# Altium schematic sheet CPU Module.SchDoc
size A2 portrait
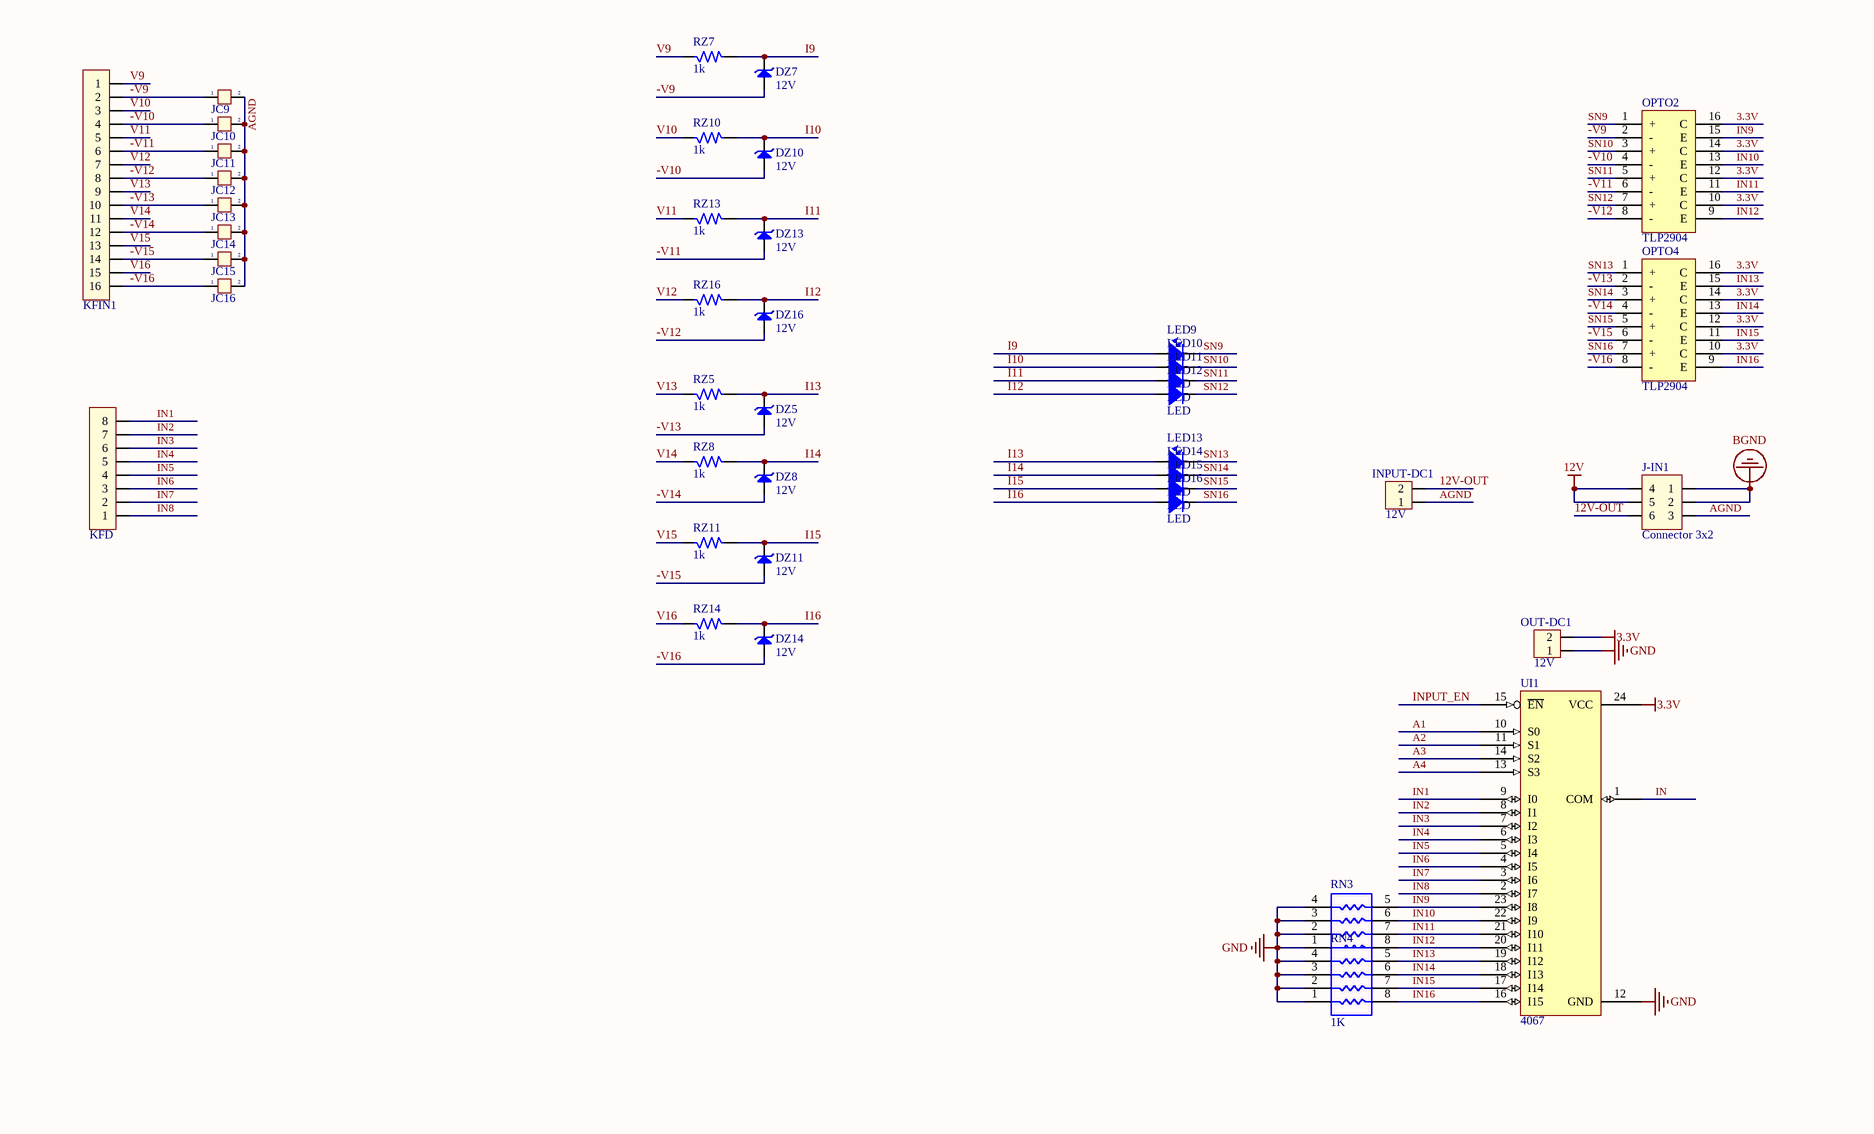
[diagram p0: CPU Module.SchDoc, top]
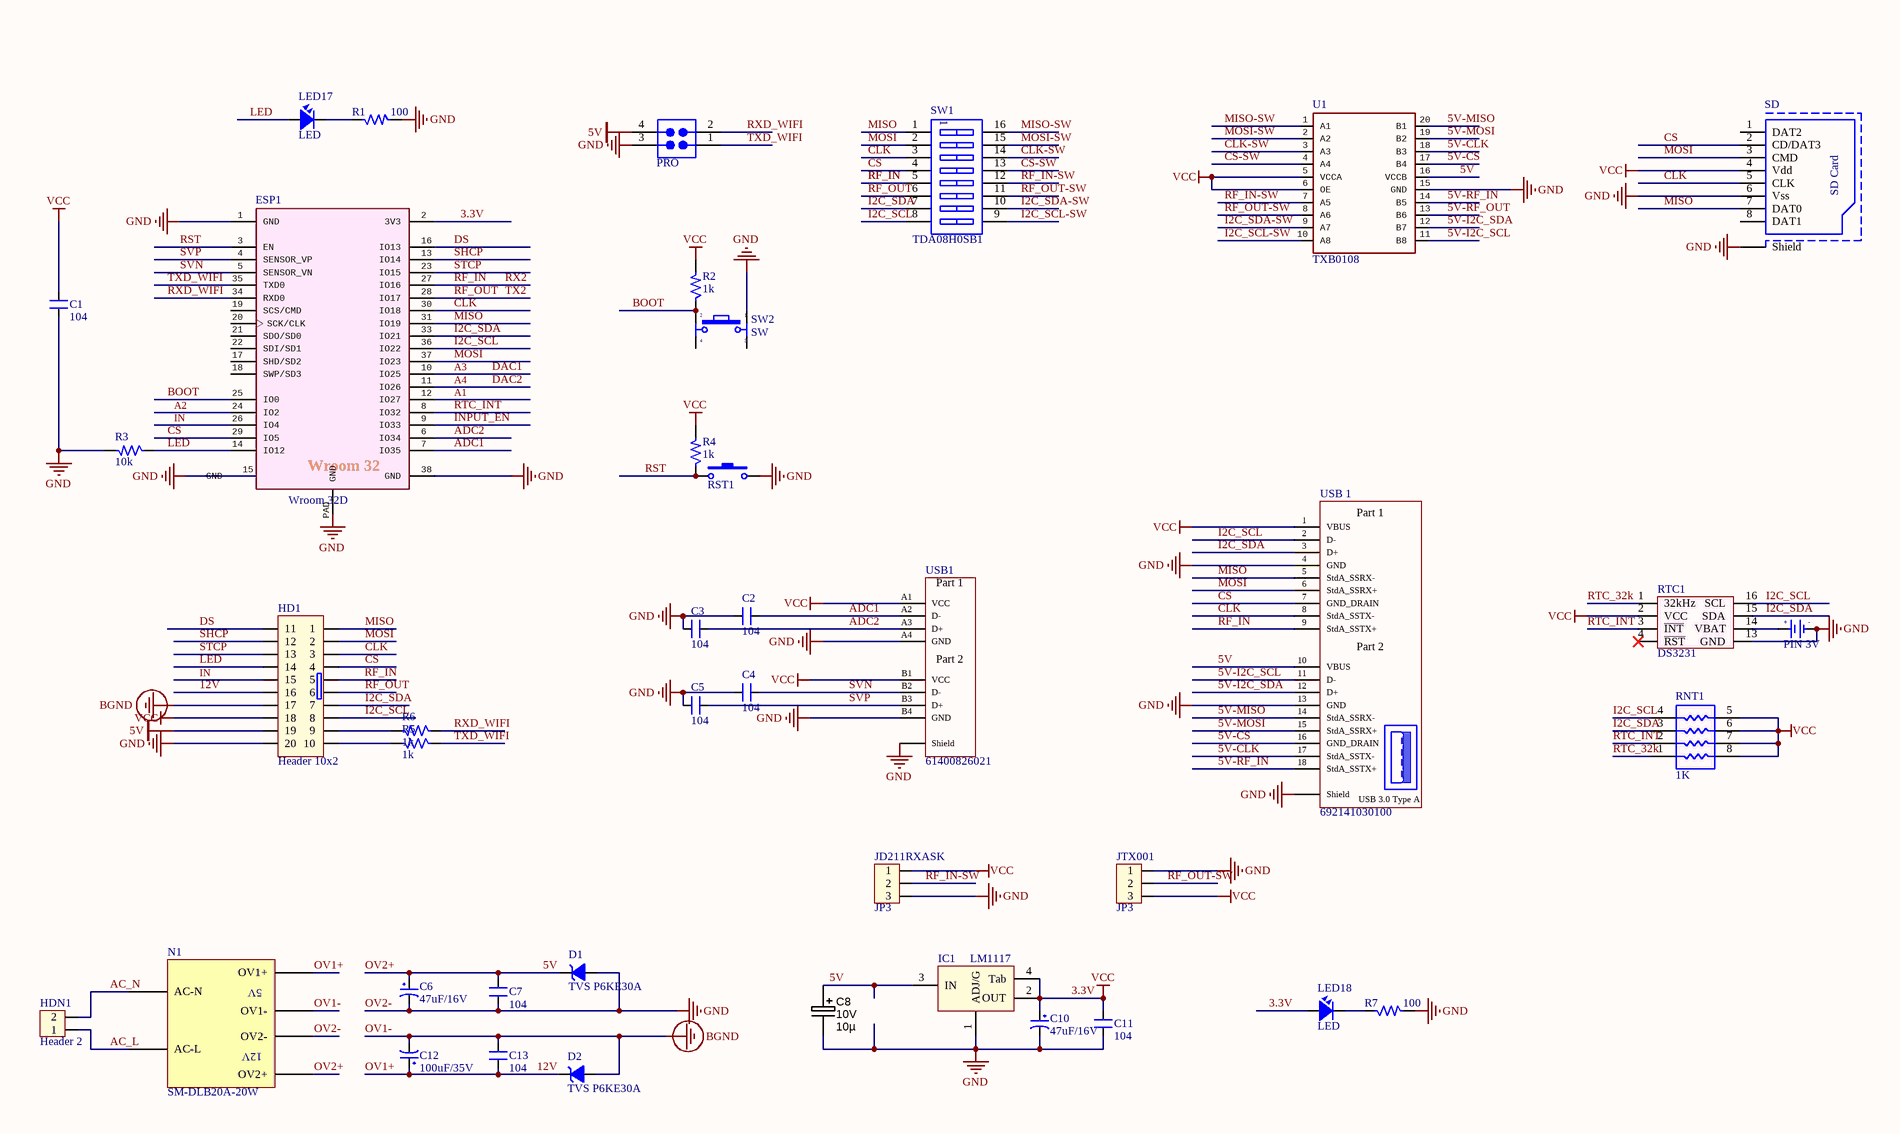
[diagram p1: CPU Module.SchDoc, bottom]

## Parts
BT1  PIN 3V  [PIN CR1220-SMD]
C1  104  [SM-0805]
C2  104  [SM-0805]
C3  104  [SM-0805]
C4  104  [SM-0805]
C5  104  [SM-0805]
C6  47uF/16V  [WCAP-AS5H_6.3x5.5]
C7  104  [SM-0805]
C8  Ratings: 10V  [CAPMP3216X180N]  (hidden comment: 10µ)
C10  47uF/16V  [WCAP-AS5H_6.3x5.5]
C11  104  [SM-0805]
C12  100uF/35V  [WCAP-AS5H_8x10.5]
C13  104  [SM-0805]
D1  TVS P6KE30A  [DO-214AA_Unidirectional]
D2  TVS P6KE30A  [DO-214AA_Unidirectional]
DZ5  12V  [DIOS 1S2P1406H]
DZ7  12V  [DIOS 1S2P1406H]
DZ8  12V  [DIOS 1S2P1406H]
DZ10  12V  [DIOS 1S2P1406H]
DZ11  12V  [DIOS 1S2P1406H]
DZ13  12V  [DIOS 1S2P1406H]
DZ14  12V  [DIOS 1S2P1406H]
DZ16  12V  [DIOS 1S2P1406H]
ESP1  Wroom 32D  [MODULE_ESP-WROOM-32]
HD1  Header 10x2  [Hed2X10S]
HDN1  Header 2  [KF211V- 2]
IC1  LM1117  [SOT223-4N]
INPUT-DC1  12V  [KF211V- 2]
J-IN1  Connector 3x2  [JP3x2]
JC9  Jumper 2  [JP2]  (value not drawn)
JC10  Jumper 2  [JP2]  (value not drawn)
JC11  Jumper 2  [JP2]  (value not drawn)
JC12  Jumper 2  [JP2]  (value not drawn)
JC13  Jumper 2  [JP2]  (value not drawn)
JC14  Jumper 2  [JP2]  (value not drawn)
JC15  Jumper 2  [JP2]  (value not drawn)
JC16  Jumper 2  [JP2]  (value not drawn)
JD211RXASK  JP3  [JP3]
JTX001  JP3  [JP3]
KFD  Header 8  [KF211V- 8]  (value not drawn)
KFIN1  Header 16  [KF211V- 16]  (value not drawn)
LED9  LED  [LED0805]
LED10  LED  [LED0805]
LED11  LED  [LED0805]
LED12  LED  [LED0805]
LED13  LED  [LED0805]
LED14  LED  [LED0805]
LED15  LED  [LED0805]
LED16  LED  [LED0805]
LED17  LED  [LED0805]
LED18  LED  [LED0805]
N1  SM-DLB20A-20W  [SM-DLB20A]
OPTO2  TLP2904  [SO-16]
OPTO4  TLP2904  [SO-16]
OUT-DC1  12V  [KF211V- 2]
PRO  61300421821  [61300421121]  (value not drawn)
R1  100  [R-0805]
R2  1k  [R-0805]
R3  10k  [R-0805]
R4  1k  [R-0805]
R5  1k  [R-0805]
R6  1k  [R-0805]
R7  100  [R-0805]
RN3  1K  [RES P4 Dual 0805/2012]
RN4  1K  [RES P4 Dual 0805/2012]
RNT1  1K  [RES P4 Dual 0805/2012]
RST1  SW-SMD  [SW-SMD]  (value not drawn)
RTC1  DS3231  [SOIC127P750X1030-16N]
RZ5  1k  [SM-1206]
RZ7  1k  [SM-1206]
RZ8  1k  [SM-1206]
RZ10  1k  [SM-1206]
RZ11  1k  [SM-1206]
RZ13  1k  [SM-1206]
RZ14  1k  [SM-1206]
RZ16  1k  [SM-1206]
SD  693072010801  [693072010801]  (value not drawn)
SW1  TDA08H0SB1  [SW8-416131160808]
SW2  SW  [SW2-D2]
U1  TXB0108  [TSSOP65P440X650-20N]
UI1  4067  [SSOP65P530X850-24N]
USB1  61400826021  [61400826021]
USB_1  692141030100  [692141030100]

## Nets
3.3V: C1.2 C10.1 C11.2 ESP1.2(3V3) HD1.18 IC1.2(OUT) IC1.4(Tab) JD211RXASK.1 JTX001.3 LED18.1 OPTO2.10(C) OPTO2.12(C) OPTO2.14(C) OPTO2.16(C) OPTO4.10(C) OPTO4.12(C) OPTO4.14(C) OPTO4.16(C) OUT-DC1.2 R2.2 R4.2 RNT1.5 RNT1.6 RNT1.7 RNT1.8 RTC1.2(VCC) SD.4(Vdd) U1.5(VCCA) U1.6(OE) UI1.24(VCC) USB1.A1(VCC) USB1.B1(VCC) USB_1.1(VBUS)  [also labelled VCC]
5V: C6.1 C7.1 C8.1 D1.2(K) HD1.19 IC1.3(IN) N1.OV2+ PRO.4 U1.16(VCCB) USB_1.10(VBUS)  [also labelled OV2+]
12V: C12.1 C13.2 D2.2(K) HD1.16 J-IN1.4 J-IN1.5 N1.OV1+  [also labelled OV1+]
OV1-: C12.2 C13.1 D2.1(A) HD1.17 J-IN1.1 J-IN1.2 N1.OV1-  [also labelled BGND]
OV2-: BT1.2(GND) C1.1 C2.2 C3.1 C4.2 C5.1 C6.2 C7.2 C8.2 C10.2 C11.1 D1.1(A) ESP1.1(GND) ESP1.15(GND) ESP1.38(GND) ESP1.PAD(GND) HD1.20 IC1.1(ADJ/G) JD211RXASK.3 JTX001.1 N1.OV2- OUT-DC1.1 PRO.3 R1.2 R3.2 R7.2 RN3.1 RN3.2 RN3.3 RN3.4 RN4.1 RN4.2 RN4.3 RN4.4 RST1.2 RTC1.13(GND) SD.6(Vss) SD.Shield SW2.1 U1.15(GND) UI1.12(GND) USB1.A4(GND) USB1.B4(GND) USB1.Shell(Shield) USB_1.4(GND) USB_1.13(GND) USB_1.Shell(Shield)  [also labelled GND]
5V-CLK: U1.18(B3) USB_1.17(StdA_SSTX-)
5V-CS: U1.17(B4) USB_1.16(GND_DRAIN)
5V-I2C_SCL: U1.11(B8) USB_1.11(D-)
5V-I2C_SDA: U1.12(B7) USB_1.12(D+)
5V-MISO: U1.20(B1) USB_1.14(StdA_SSRX-)
5V-MOSI: U1.19(B2) USB_1.15(StdA_SSRX+)
5V-RF_IN: U1.14(B5) USB_1.18(StdA_SSTX+)
5V-RF_OUT: U1.13(B6)
12V-OUT: INPUT-DC1.2 J-IN1.6
-V9: DZ7.1(A) JC9.1 KFIN1.2 OPTO2.2(-)
-V10: DZ10.1(A) JC10.1 KFIN1.4 OPTO2.4(-)
-V11: DZ13.1(A) JC11.1 KFIN1.6 OPTO2.6(-)
-V12: DZ16.1(A) JC12.1 KFIN1.8 OPTO2.8(-)
-V13: DZ5.1(A) JC13.1 KFIN1.10 OPTO4.2(-)
-V14: DZ8.1(A) JC14.1 KFIN1.12 OPTO4.4(-)
-V15: DZ11.1(A) JC15.1 KFIN1.14 OPTO4.6(-)
-V16: DZ14.1(A) JC16.1 KFIN1.16 OPTO4.8(-)
A1: ESP1.12(IO27) UI1.10(S0)
A2: ESP1.24(IO2) UI1.11(S1)
A3: ESP1.10(IO25) UI1.14(S2)  [also labelled DAC1]
A4: ESP1.11(IO26) UI1.13(S3)  [also labelled DAC2]
AC_L: HDN1.1 N1.AC-L
AC_N: HDN1.2 N1.AC-N
ADC1: C2.1 ESP1.7(IO35) USB1.A2(D-)
ADC2: C3.2 ESP1.6(IO34) USB1.A3(D+)
AGND: INPUT-DC1.1 J-IN1.3 JC9.2 JC10.2 JC11.2 JC12.2 JC13.2 JC14.2 JC15.2 JC16.2
BOOT: ESP1.25(IO0) R2.1 SW2.2
CLK: ESP1.30(IO18) HD1.3 SD.5(CLK) SW1.3 USB_1.8(StdA_SSTX-)
CLK-SW: SW1.14 U1.3(A3)
CS: ESP1.29(IO5) HD1.4 SD.2(CD/DAT3) SW1.4 USB_1.7(GND_DRAIN)
CS-SW: SW1.13 U1.4(A4)
DS: ESP1.16(IO13) HD1.11
I2C_SCL: ESP1.36(IO22) HD1.8 RNT1.4 RTC1.16(SCL) SW1.8 USB_1.2(D-)
I2C_SCL-SW: SW1.9 U1.10(A8)
I2C_SDA: ESP1.33(IO21) HD1.7 RNT1.3 RTC1.15(SDA) SW1.7 USB_1.3(D+)
I2C_SDA-SW: SW1.10 U1.9(A7)
I9: DZ7.2(K) LED9.1 RZ7.2
I10: DZ10.2(K) LED10.1 RZ10.2
I11: DZ13.2(K) LED11.1 RZ13.2
I12: DZ16.2(K) LED12.1 RZ16.2
I13: DZ5.2(K) LED13.1 RZ5.2
I14: DZ8.2(K) LED14.1 RZ8.2
I15: DZ11.2(K) LED15.1 RZ11.2
I16: DZ14.2(K) LED16.1 RZ14.2
IN: ESP1.26(IO4) HD1.15 UI1.1(COM)
IN1: KFD.8 UI1.9(I0)
IN2: KFD.7 UI1.8(I1)
IN3: KFD.6 UI1.7(I2)
IN4: KFD.5 UI1.6(I3)
IN5: KFD.4 UI1.5(I4)
IN6: KFD.3 UI1.4(I5)
IN7: KFD.2 UI1.3(I6)
IN8: KFD.1 UI1.2(I7)
IN9: OPTO2.15(E) RN3.5 UI1.23(I8)
IN10: OPTO2.13(E) RN3.6 UI1.22(I9)
IN11: OPTO2.11(E) RN3.7 UI1.21(I10)
IN12: OPTO2.9(E) RN3.8 UI1.20(I11)
IN13: OPTO4.15(E) RN4.5 UI1.19(I12)
IN14: OPTO4.13(E) RN4.6 UI1.18(I13)
IN15: OPTO4.11(E) RN4.7 UI1.17(I14)
IN16: OPTO4.9(E) RN4.8 UI1.16(I15)
INPUT_EN: ESP1.9(IO33) UI1.15(~{EN})
LED: ESP1.14(IO12) HD1.14 LED17.1 R3.1
MISO: ESP1.31(IO19) HD1.1 SD.7(DAT0) SW1.1 USB_1.5(StdA_SSRX-)
MISO-SW: SW1.16 U1.1(A1)
MOSI: ESP1.37(IO23) HD1.2 SD.3(CMD) SW1.2 USB_1.6(StdA_SSRX+)
MOSI-SW: SW1.15 U1.2(A2)
RF_IN: ESP1.27(IO16) HD1.5 SW1.5 USB_1.9(StdA_SSTX+)  [also labelled RX2]
RF_IN-SW: JD211RXASK.2 SW1.12 U1.7(A5)
RF_OUT: ESP1.28(IO17) HD1.6 SW1.6  [also labelled TX2]
RF_OUT-SW: JTX001.2 SW1.11 U1.8(A6)
RST: ESP1.3(EN) R4.1 RST1.1
RTC_32k: RNT1.1 RTC1.1(32kHz)
RTC_INT: ESP1.8(IO32) RNT1.2 RTC1.3(~{INT})
RXD_WIFI: ESP1.34(RXD0) PRO.2 R6.1
SHCP: ESP1.13(IO14) HD1.12
SN9: LED9.2 OPTO2.1(+)
SN10: LED10.2 OPTO2.3(+)
SN11: LED11.2 OPTO2.5(+)
SN12: LED12.2 OPTO2.7(+)
SN13: LED13.2 OPTO4.1(+)
SN14: LED14.2 OPTO4.3(+)
SN15: LED15.2 OPTO4.5(+)
SN16: LED16.2 OPTO4.7(+)
STCP: ESP1.23(IO15) HD1.13
SVN: C4.1 ESP1.5(SENSOR_VN) USB1.B2(D-)
SVP: C5.2 ESP1.4(SENSOR_VP) USB1.B3(D+)
TXD_WIFI: ESP1.35(TXD0) PRO.1 R5.1
V9: KFIN1.1 RZ7.1
V10: KFIN1.3 RZ10.1
V11: KFIN1.5 RZ13.1
V12: KFIN1.7 RZ16.1
V13: KFIN1.9 RZ5.1
V14: KFIN1.11 RZ8.1
V15: KFIN1.13 RZ11.1
V16: KFIN1.15 RZ14.1
NetBT1_1: BT1.1(+3V) RTC1.14(VBAT)
NetHD1_9: HD1.9 R6.2
NetHD1_10: HD1.10 R5.2
NetLED17_2: LED17.2 R1.1
NetLED18_2: LED18.2 R7.1

Not connected (* = marked no-connect by the designer): ESP1 17(SHD/SD2) 18(SWP/SD3) 19(SCS/CMD) 20(SCK/CLK) 21(SDO/SD0) 22(SDI/SD1); RTC1 4(~{RST})*; SD 1(DAT2) 8(DAT1); SW2 3 4

## Notes on the sheet
- Title
- Size:
- Date:
- File:
- A2
- Number:
- Time:
- Revision:
- Sheet
- of
- (in symbol ESP-WROOM-32) Wroom 32
- (in symbol PIN 3V) +; -
- (in symbol SD-693072010801) SD Card
- (in symbol SM-DLB20A-20W) 5V; 12V
- (in symbol USB 2.0 Type A Female THR Stacked) Part 1; Part 2
- (in symbol USB 3.0 Type A Female THR Stacked) Part 1; Part 2

## Library data of the parts
BT1 = PIN 3V: Lithium Battery Holder for CR2032 3V Cell
C1-C5 C7 C11 C13 = CM: Cap SMD; Value: 103
C6 C10 C12 = CP3: Cap 100uF/35V - 470uF/16V; Value: 100uF/35V/50V; Description 1: 1000uF/6,3V - 470uF/16V - 330uF - 25V; Description 2: 220uF/35V - 100uF/50V - 63V - 4,7uF/200V; Description 3: 22uF => 33uF100V - 3,3uF => 4,7uF/250V; Description 4: 2,2uF =>3,3uF/350 - 2,2uF/400V - 1uF/450V
C8 = CAPT_10u_0805_10V: Capacitor SMD Tantalum 10uF 20% 10V 0805; Manufacturer 1: AVX Corporation; Manufacturer Part Number 1: TAJP106M010RNJ; Package / Case: 0805 (2012 metric); Tolerance: ±20%; Material: Tantalum; Supplier 1: Digi-Key; Supplier Part Number 1: 478-3281-1-ND; Value: 10µ
D1 D2 = DZ: Diode Zenner; Value: 3v3
DZ5 DZ7 DZ8 DZ10 DZ11 DZ13 DZ14 DZ16 = DIODE Zener: DIODE GEN PURP 75V 200MA LLDS
ESP1 = ESP-WROOM-32: MF: Olimex LTD; Availability: Unavailable; Package: Module Olimex LTD; MP: ESP-WROOM-32; Price: None
HD1 = HED10X2: Value: Header 5x2
HDN1 INPUT-DC1 OUT-DC1 = Hed2: Header 2 (Green); Value: Header 2
IC1 = LM1117: 3v3; Value: LM317
J-IN1 = JP3x2: Value: Connector 3x2
JC9-JC16 = JP 2: Value: JP 2
JD211RXASK JTX001 = Con3: Connector 3; Value: Connector 3; Link: https://item.taobao.com/item.htm?spm=a1z10.5-c-s.w4002-21392083054.13.19436795vR5nsY&id=593144622578
KFD = KF 8: KF211R-5.0; Value: Header 4
KFIN1 = KF 16: KF211R-5.0; Value: Header 4
LED9-LED18 = LED: LED Single colour Green and Red; Value: LED 3 ly Single Colour
OPTO2 OPTO4 = PC817 x 4: PC817 OPTO
PRO = JP2x2 2.54MM: 2.54 mm Dual Socket Header, 04p; PublishedDate: July 2016; Publisher: Wurth Elektronik; ComponentLink1Description: Manufacturer; ComponentLink1URL: http://www.we-online.de; ComponentLink2Description: Datasheet; ComponentLink2URL: http://katalog.we-online.de/em/datasheet/6130xx21821.pdf; PartNumber: 61300421821; PinNumber: 04p
R1-R7 RZ5 RZ7 RZ8 RZ10 RZ11 RZ13 RZ14 RZ16 = R: Resistor 1/4W; Value: R1/4W - 1K
RN3 RN4 RNT1 = Respack 4 Dual: Value: 10K
RST1 = SW-SMD: Switch; Published: 24-Mar-1999; LatestRevisionDate: 17-Jul-2002; LatestRevisionNote: Re-released for DXP Platform.; PackageReference: SPST-2; Publisher: Altium Limited
RTC1 = DS3231: I2C RTC/TCXO/Crystal
SD = SD-693072010801: Micro SD Card Connector - Hinge - 8 pins; Published: June 2016; Publisher: Wurth Elektronik; ComponentLink1Description: Manufacturer; ComponentLink1URL: http://www.we-online.de; ComponentLink2Description: Datasheet; ComponentLink2URL: http://katalog.we-online.de/em/datasheet/693072010801.pdf; PartNumber: 693072010801
SW1 = SW 8P: WS-DITV 2.54 mm small compact THT with raised actuator, 8p; Part Number: 418127270908; Operation Force: 1000g; Pitch: 2.54mm; Pole Number: 8; Actuator Type: Raise Type; ComponentLink1Description: Manufacturer; ComponentLink1URL: http://www.we-online.de; ComponentLink2Description: Datasheet; ComponentLink2URL: http://katalog.we-online.de/em/datasheet/4181272709xx.pdf; Published Date: June 2017; Publisher: Wurth Elektronik
SW2 = SW4: Switch button 4 pin; Value: Button chip 4 pin
U1 = TXB0108: MF: Texas Instruments; Price: None; Package: None; Availability: Unavailable; MP: TXB0108
UI1 = MUX-74HC4067
USB1 = USB 2.0 Type A Female THR Stacked: PartVertical: 614008235023; Interface Type: Type A; Sub-Family: USB 2.0; Gender: Receptacle; ComponentLink1Description: Manufacturer; ComponentLink1URL: http://www.we-online.de; ComponentLink2Description: Datasheet; ComponentLink2URL: http://katalog.we-online.de/em/datasheet/61400826021.pdf; PartHorizontal: 61400826021; Published Date: April 2017; Publisher: Wurth Elektronik; Type: Stacked Horizontal; Construction: THT
USB_1 = USB 3.0 Type A Female THR Stacked: USB 3.0 Type A; Interface Type: Type A; Sub-Family: USB 3.0; Gender: Receptacle; ComponentLink1Description: Manufacturer; ComponentLink1URL: http://www.we-online.de; ComponentLink2Description: Datasheet; ComponentLink2URL: http://katalog.we-online.de/em/datasheet/692141030100.pdf; Part Number: 692141030100; Published Date: April 2017; Publisher: Wurth Elektronik; Type: Stacked Horizontal; Construction: THR